# Altium schematic sheet Intermediate_LCL_Top_20230320.SchDoc
size A1; SheetNumber: 1; SheetTotal: 5
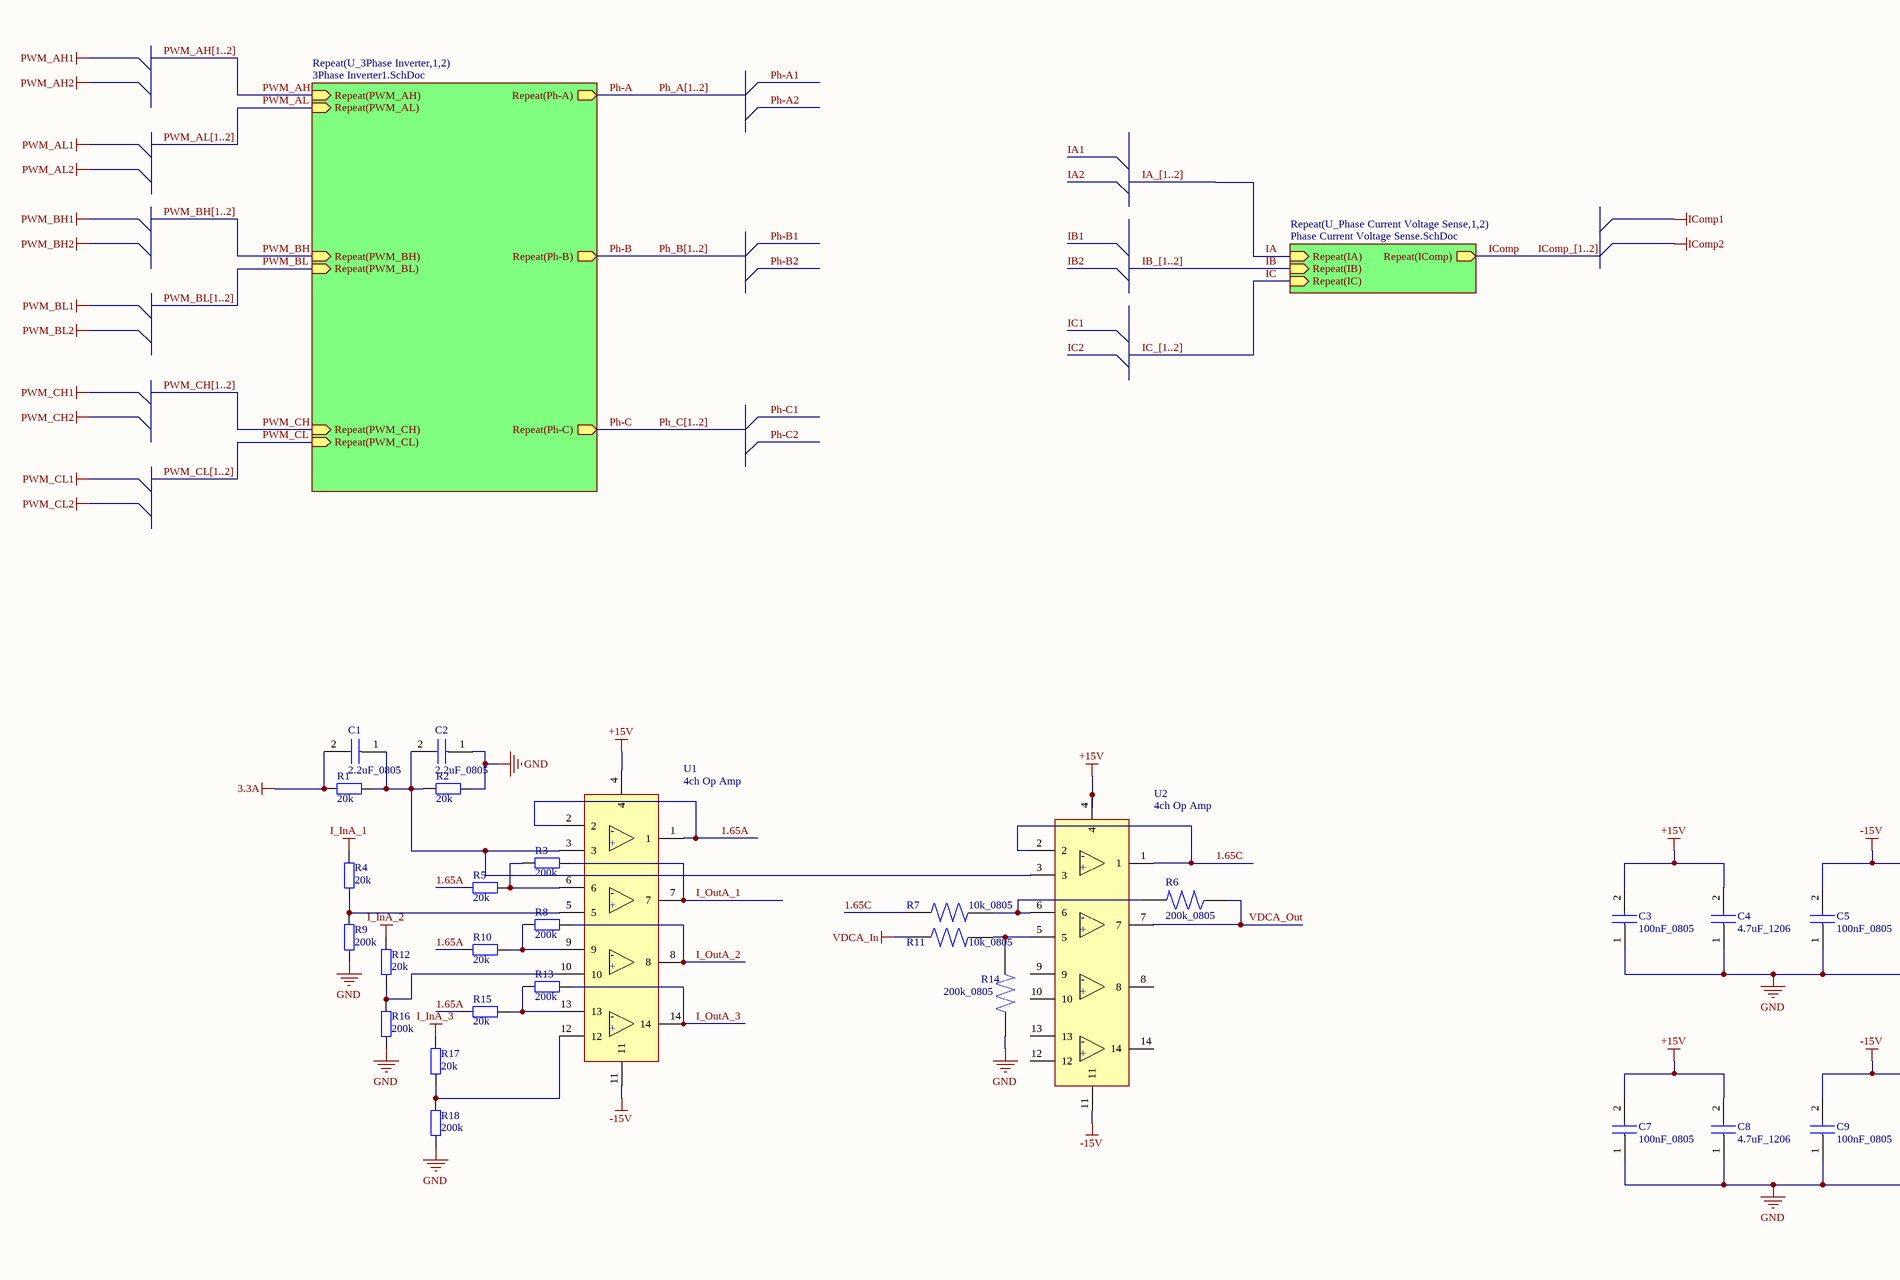
[diagram p0: Intermediate_LCL_Top_20230320.SchDoc, top left]
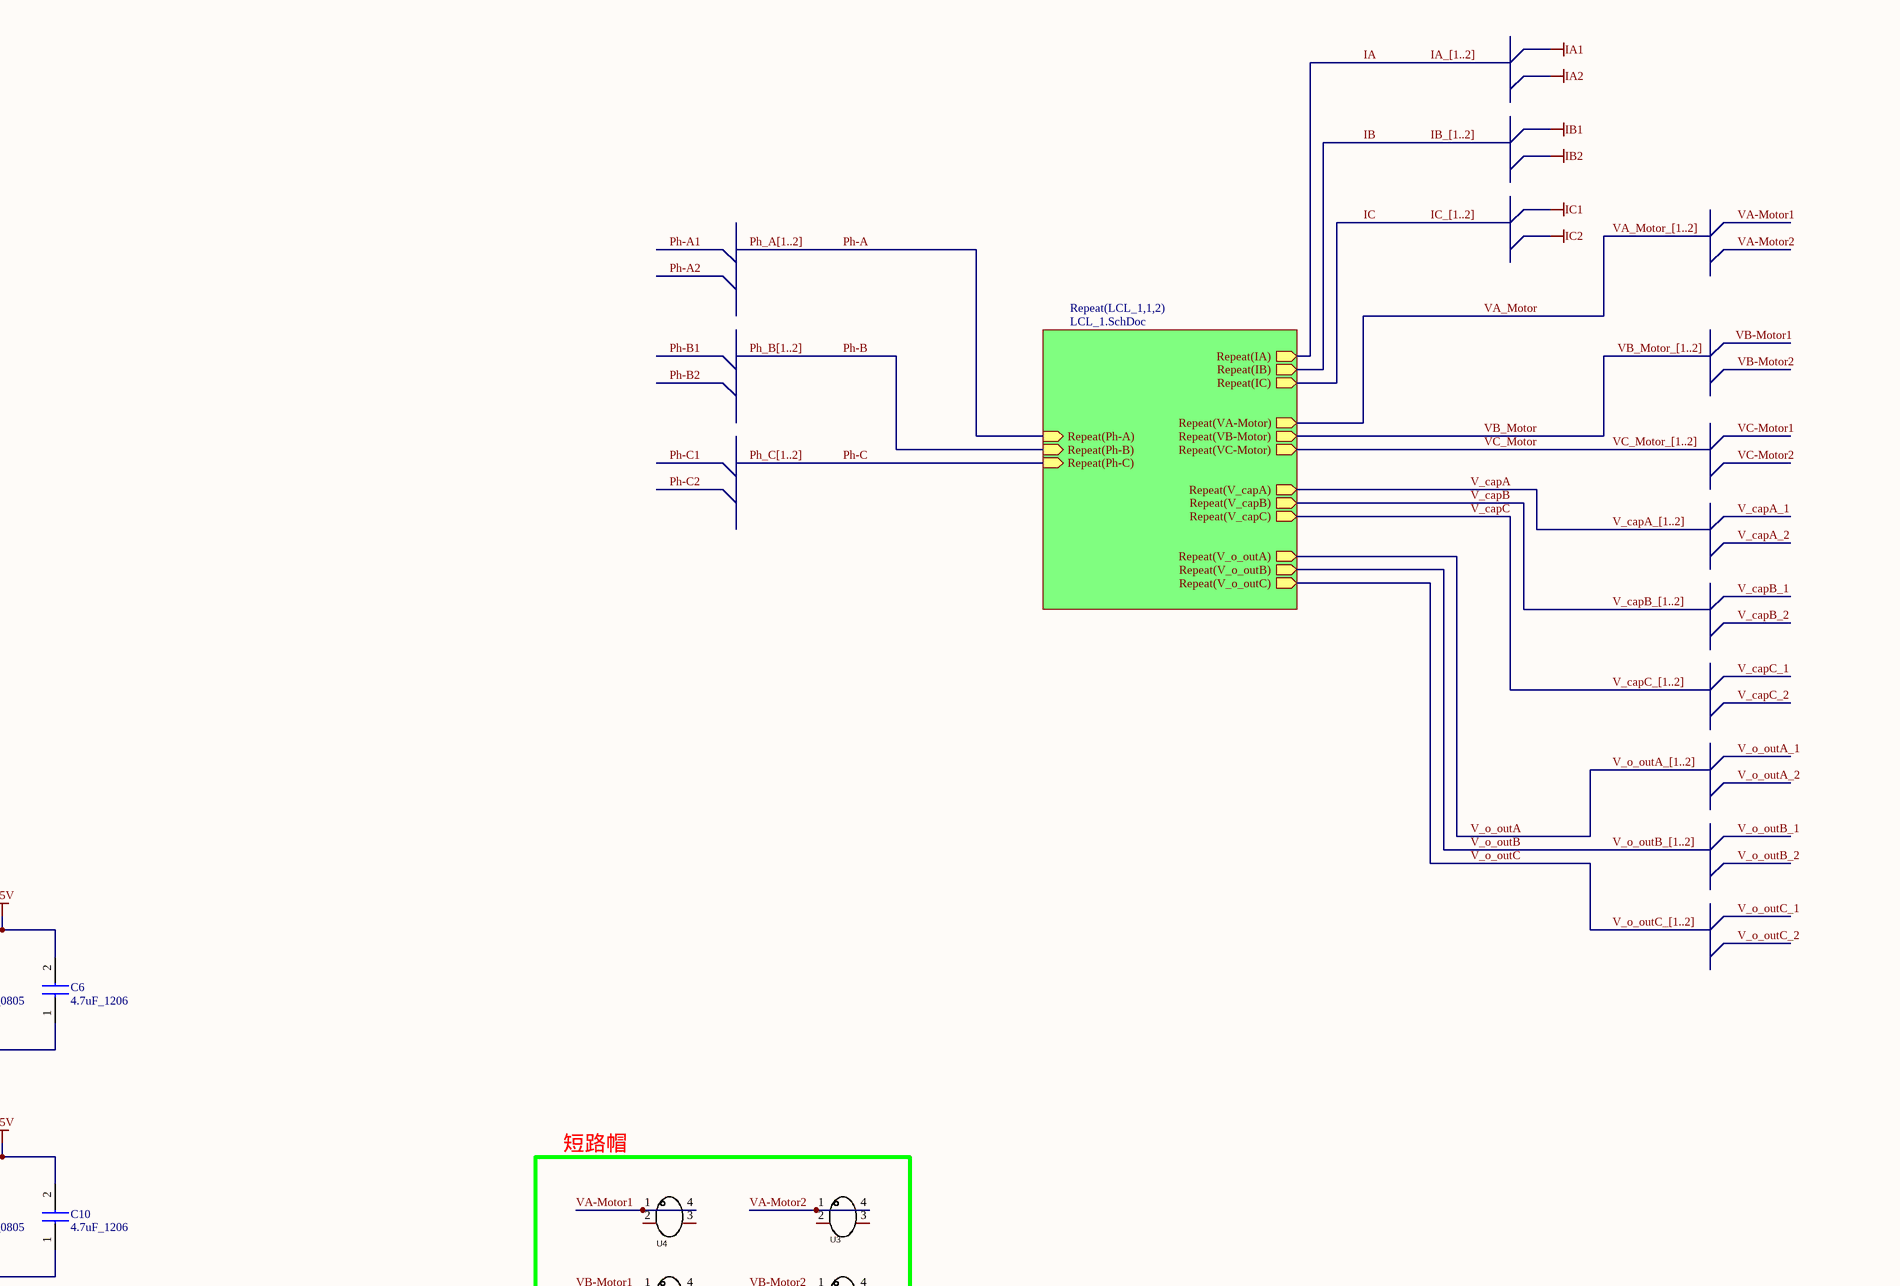
[diagram p1: Intermediate_LCL_Top_20230320.SchDoc, top right]
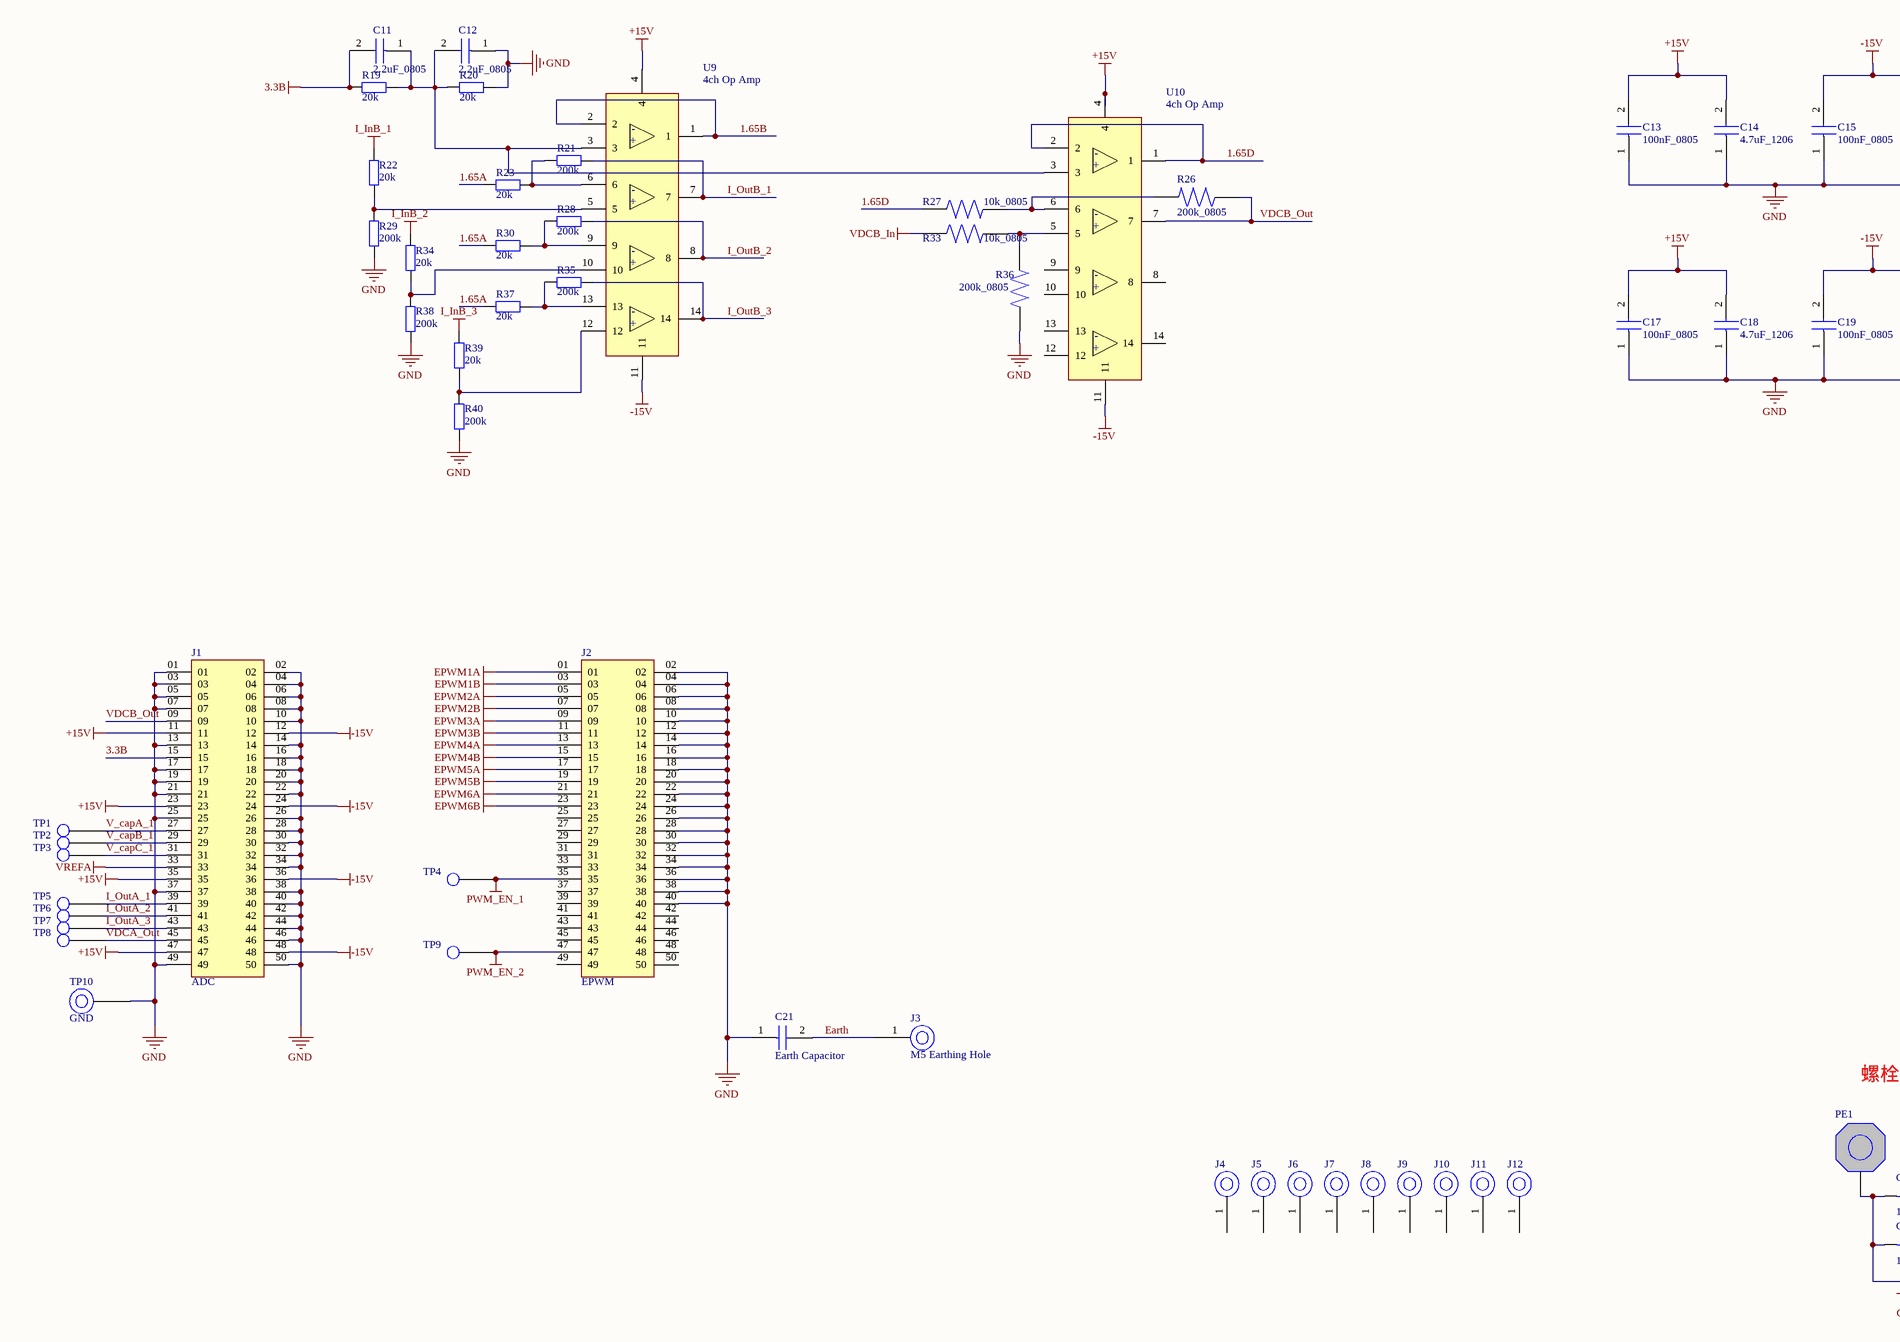
[diagram p2: Intermediate_LCL_Top_20230320.SchDoc, bottom left]
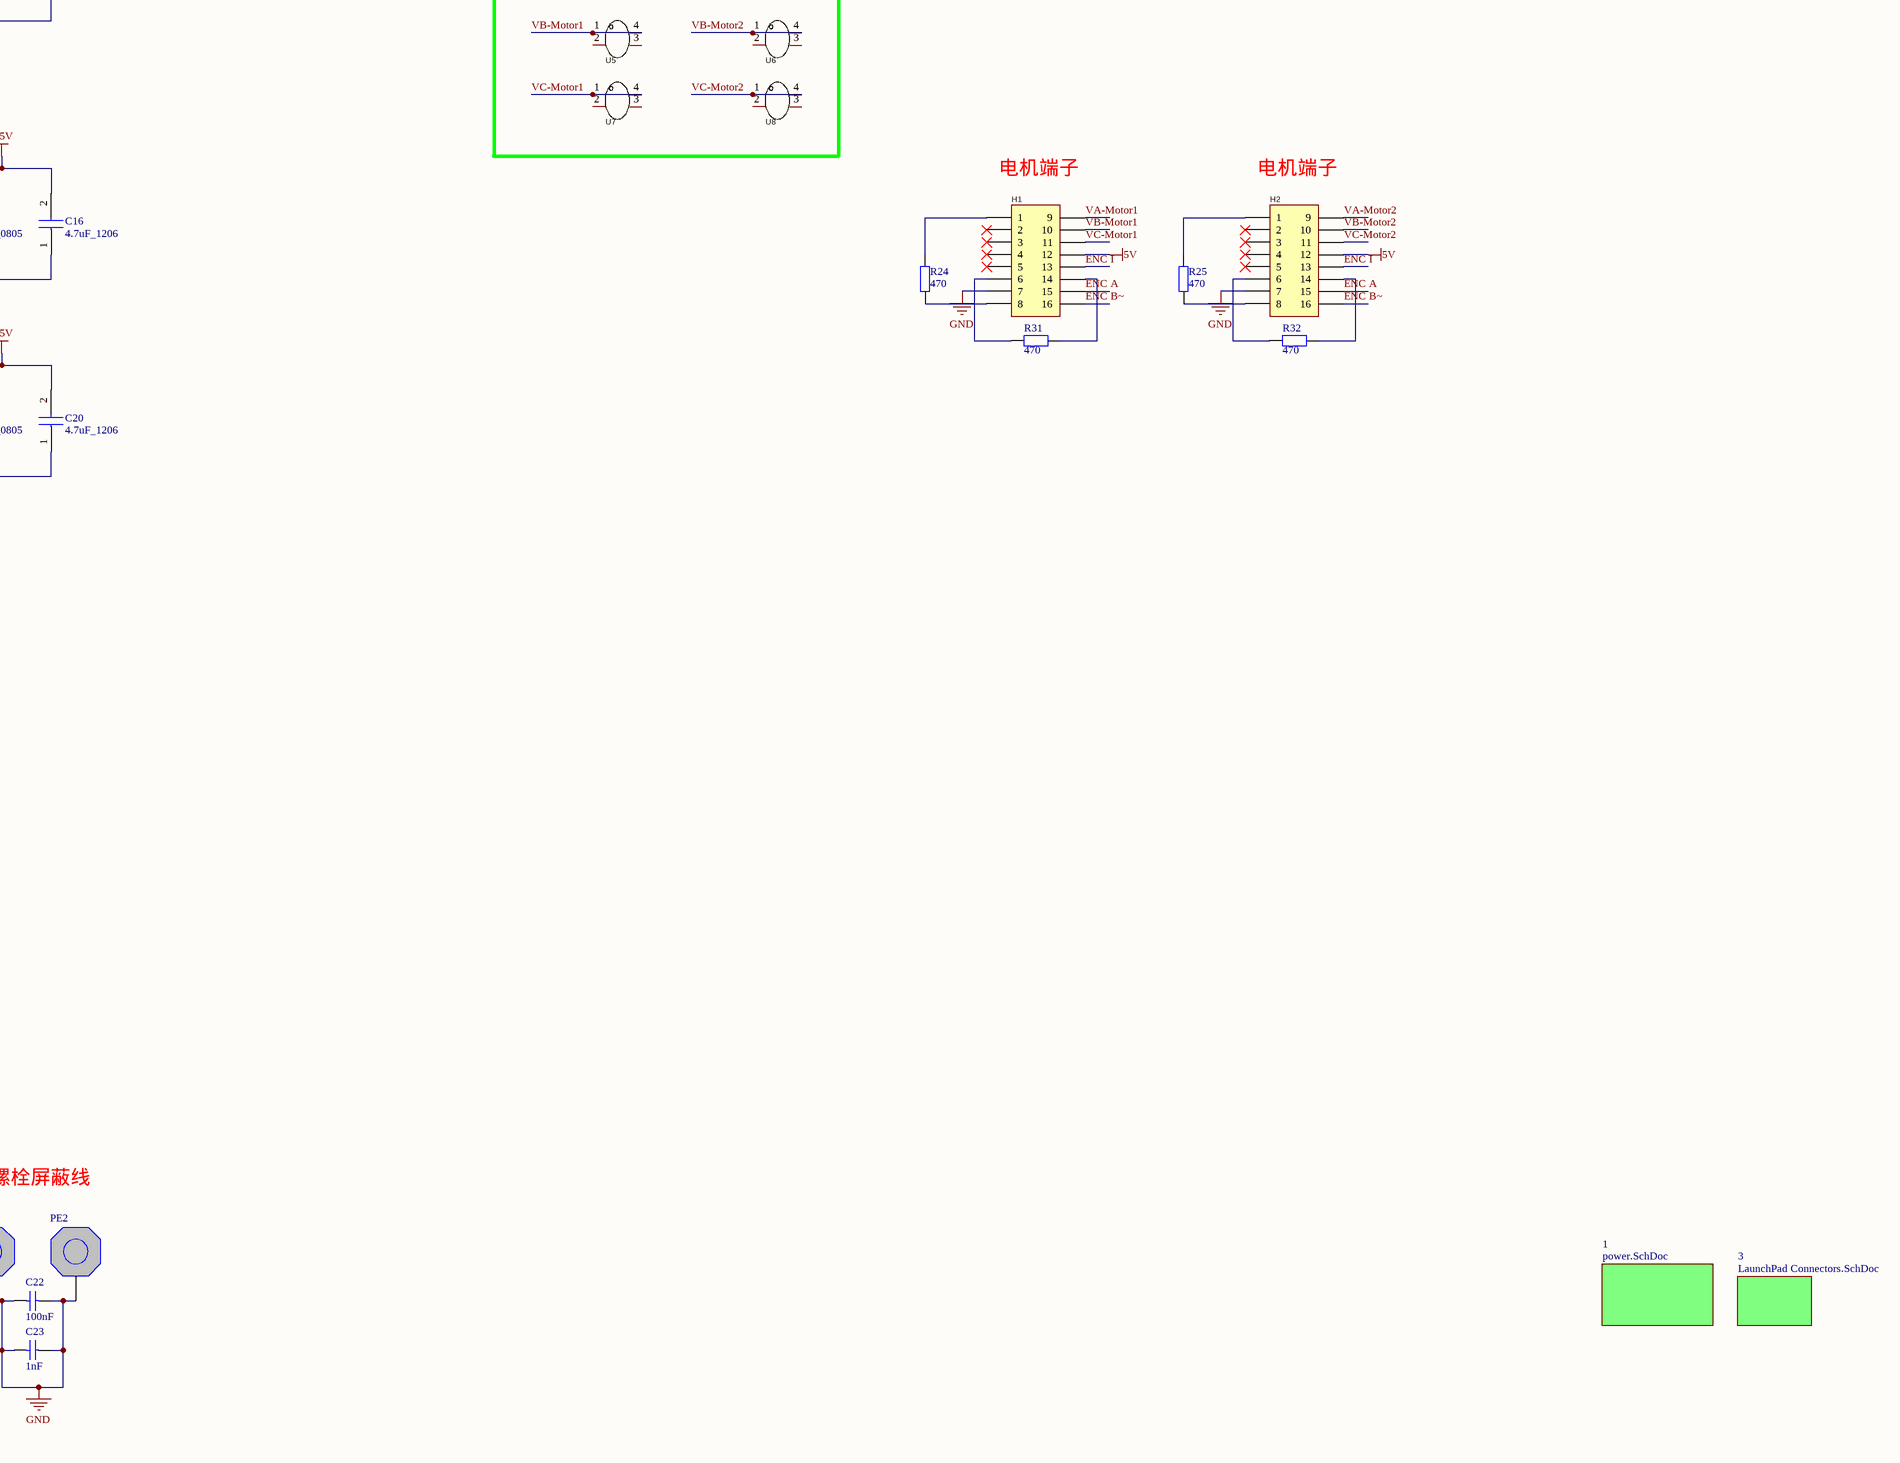
[diagram p3: Intermediate_LCL_Top_20230320.SchDoc, bottom right]

## Parts
C1  2.2uF_0805  [CAPC1608X06N]
C2  2.2uF_0805  [CAPC1608X06N]
C3  100nF_0805  [CAPC1608X06N]
C4  4.7uF_1206  [CAPC1608X06N]
C5  100nF_0805  [CAPC1608X06N]
C6  4.7uF_1206  [CAPC1608X06N]
C7  100nF_0805  [CAPC1608X06N]
C8  4.7uF_1206  [CAPC1608X06N]
C9  100nF_0805  [CAPC1608X06N]
C10  4.7uF_1206  [CAPC1608X06N]
C11  2.2uF_0805  [CAPC1608X06N]
C12  2.2uF_0805  [CAPC1608X06N]
C13  100nF_0805  [CAPC1608X06N]
C14  4.7uF_1206  [CAPC1608X06N]
C15  100nF_0805  [CAPC1608X06N]
C16  4.7uF_1206  [CAPC1608X06N]
C17  100nF_0805  [CAPC1608X06N]
C18  4.7uF_1206  [CAPC1608X06N]
C19  100nF_0805  [CAPC1608X06N]
C20  4.7uF_1206  [CAPC1608X06N]
C21  Earth Capacitor  [RAD-0.3]
C22  100nF  [CAPC1608X06N]
C23  1nF  [CAPC1608X06N]
H1  HC-5557-2*8AW  [CONN-TH_16P-P4.20_5557-2X8AW]  (value not drawn)
H2  HC-5557-2*8AW  [CONN-TH_16P-P4.20_5557-2X8AW]  (value not drawn)
J1  ADC  [SHF-125-01-L-D-RA]
J2  EPWM  [SHF-125-01-L-D-RA]
J3  M5 Earthing Hole  [M5 Earthing Hole]
J4  M5 Mounting Hole  [M5 Mounting Hole]  (value not drawn)
J5  M5 Mounting Hole  [M5 Mounting Hole]  (value not drawn)
J6  M5 Mounting Hole  [M5 Mounting Hole]  (value not drawn)
J7  M5 Mounting Hole  [M5 Mounting Hole]  (value not drawn)
J8  M5 Mounting Hole  [M5 Mounting Hole]  (value not drawn)
J9  M5 Mounting Hole  [M5 Mounting Hole]  (value not drawn)
J10  M5 Mounting Hole  [M5 Mounting Hole]  (value not drawn)
J11  M5 Mounting Hole  [M5 Mounting Hole]  (value not drawn)
J12  M5 Mounting Hole  [M5 Mounting Hole]  (value not drawn)
PE1  PE  [PE1]  (value not drawn)
PE2  PE  [PE1]  (value not drawn)
R1  20k  [RESC1608X05N]
R2  20k  [RESC1608X05N]
R3  200k  [RESC1608X05N]
R4  20k  [RESC1608X05N]
R5  20k  [RESC1608X05N]
R6  200k_0805  [RESC1608X05N]
R7  10k_0805  [RESC1608X05N]
R8  200k  [RESC1608X05N]
R9  200k  [RESC1608X05N]
R10  20k  [RESC1608X05N]
R11  10k_0805  [RESC1608X05N]
R12  20k  [RESC1608X05N]
R13  200k  [RESC1608X05N]
R14  200k_0805  [RESC1608X05N]
R15  20k  [RESC1608X05N]
R16  200k  [RESC1608X05N]
R17  20k  [RESC1608X05N]
R18  200k  [RESC1608X05N]
R19  20k  [RESC1608X05N]
R20  20k  [RESC1608X05N]
R21  200k  [RESC1608X05N]
R22  20k  [RESC1608X05N]
R23  20k  [RESC1608X05N]
R24  470  [RESC1608X05N]
R25  470  [RESC1608X05N]
R26  200k_0805  [RESC1608X05N]
R27  10k_0805  [RESC1608X05N]
R28  200k  [RESC1608X05N]
R29  200k  [RESC1608X05N]
R30  20k  [RESC1608X05N]
R31  470  [RESC1608X05N]
R32  470  [RESC1608X05N]
R33  10k_0805  [RESC1608X05N]
R34  20k  [RESC1608X05N]
R35  200k  [RESC1608X05N]
R36  200k_0805  [RESC1608X05N]
R37  20k  [RESC1608X05N]
R38  200k  [RESC1608X05N]
R39  20k  [RESC1608X05N]
R40  200k  [RESC1608X05N]
TP1  VC_1A  [PCB 1.32mm TestPoint]  (value not drawn)
TP2  VC_1B  [PCB 1.32mm TestPoint]  (value not drawn)
TP3  VC_1C  [PCB 1.32mm TestPoint]  (value not drawn)
TP4  PWMEN1  [PCB 1.32mm TestPoint]  (value not drawn)
TP5  I1  [PCB 1.32mm TestPoint]  (value not drawn)
TP6  I2  [PCB 1.32mm TestPoint]  (value not drawn)
TP7  I3  [PCB 1.32mm TestPoint]  (value not drawn)
TP8  VDC  [PCB 1.32mm TestPoint]  (value not drawn)
TP9  PWMEN2  [PCB 1.32mm TestPoint]  (value not drawn)
TP10  GND  [1.9mm Hole]
U1  4ch Op Amp  [SOIC-14]
U2  4ch Op Amp  [SOIC-14]
U3  TM54111092-1250  [CONN-TH_TM54111092-1250]  (value not drawn)
U4  TM54111092-1250  [CONN-TH_TM54111092-1250]  (value not drawn)
U5  TM54111092-1250  [CONN-TH_TM54111092-1250]  (value not drawn)
U6  TM54111092-1250  [CONN-TH_TM54111092-1250]  (value not drawn)
U7  TM54111092-1250  [CONN-TH_TM54111092-1250]  (value not drawn)
U8  TM54111092-1250  [CONN-TH_TM54111092-1250]  (value not drawn)
U9  4ch Op Amp  [SOIC-14]
U10  4ch Op Amp  [SOIC-14]

## Sub-sheets
1 = power.SchDoc: no entries
3 = LaunchPad Connectors.SchDoc: no entries
Repeat(LCL_1,1,2) = LCL_1.SchDoc: Repeat(Ph-A) (in), Repeat(Ph-B) (in), Repeat(Ph-C) (in), Repeat(IA) (out), Repeat(IB) (out), Repeat(IC) (out), Repeat(VA-Motor) (out), Repeat(VB-Motor) (out), Repeat(VC-Motor) (out), Repeat(V_o_outA) (out), Repeat(V_o_outB) (out), Repeat(V_o_outC) (out), Repeat(V_capA) (out), Repeat(V_capB) (out), Repeat(V_capC) (out)
Repeat(U_3Phase Inverter,1,2) = 3Phase Inverter1.SchDoc: Repeat(PWM_AH) (in), Repeat(PWM_AL) (in), Repeat(Ph-A) (out), Repeat(PWM_BH) (in), Repeat(PWM_BL) (in), Repeat(PWM_CH) (in), Repeat(PWM_CL) (in), Repeat(Ph-B) (out), Repeat(Ph-C) (out)
Repeat(U_Phase Current Voltage Sense,1,2) = Phase Current Voltage Sense.SchDoc: Repeat(IA) (in), Repeat(IB) (in), Repeat(IC) (in), Repeat(IComp) (out)

## Nets
3.3A: C1.2 R1.2
3.3B: C11.2 J1.15 R19.2
5V: H1.8(12) H2.8(12)
+15V: C3.2 C4.2 C7.2 C8.2 C13.2 C14.2 C17.2 C18.2 J1.11 J1.23 J1.35 J1.47 U1.4 U2.4 U9.4 U10.4
-15V: C5.2 C6.2 C9.2 C10.2 C15.2 C16.2 C19.2 C20.2 J1.12 J1.24 J1.36 J1.48 U1.11 U2.11 U9.11 U10.11
EPWM1A: J2.01
EPWM1B: J2.03
EPWM2A: J2.05
EPWM2B: J2.07
EPWM3A: J2.09
EPWM3B: J2.11
EPWM4A: J2.13
EPWM4B: J2.15
EPWM5A: J2.17
EPWM5B: J2.19
EPWM6A: J2.21
EPWM6B: J2.23
GND: C2.1 C3.1 C4.1 C5.1 C6.1 C7.1 C8.1 C9.1 C10.1 C12.1 C13.1 C14.1 C15.1 C16.1 C17.1 C18.1 C19.1 C20.1 C21.1 C22.1 C22.2 C23.1 C23.2 H1.13(7) H2.13(7) J1.01 J1.02 J1.03 J1.04 J1.05 J1.06 J1.07 J1.08 J1.10 J1.13 J1.14 J1.16 J1.17 J1.18 J1.19 J1.20 J1.21 J1.22 J1.25 J1.26 J1.28 J1.30 J1.32 J1.34 J1.37 J1.38 J1.40 J1.42 J1.44 J1.46 J1.49 J1.50 J2.02 J2.04 J2.06 J2.08 J2.10 J2.12 J2.14 J2.16 J2.18 J2.20 J2.22 J2.24 J2.26 J2.28 J2.30 J2.32 J2.34 J2.36 J2.38 J2.40 PE1.1(PE) PE2.1(PE) R2.1 R9.1 R14.2 R16.1 R18.1 R20.1 R29.1 R36.2 R38.1 R40.1 TP10.1
I_InA_1: R4.2
I_InA_2: R12.2
I_InA_3: R17.2
I_InB_1: R22.2
I_InB_2: R34.2
I_InB_3: R39.2
PWM_EN_1: J2.35 TP4.1
PWM_EN_2: J2.47 TP9.1
VDCA_In: R11.1
VDCB_In: R33.1
VREFA: J1.33
1.65A: R5.2 R10.2 R15.2 R23.2 R30.2 R37.2 U1.1 U1.2
1.65B: U9.1 U9.2
1.65C: R7.1 U2.1 U2.2
1.65D: R27.1 U10.1 U10.2
Earth: C21.2 J3.1
ENC A: H1.14(15) H2.14(15)
ENC B~: H1.16 H2.16
ENC I: H1.10(13) H2.10(13)
I_OutA_1: J1.39 R3.1 TP5.1 U1.7
I_OutA_2: J1.41 R8.1 TP6.1 U1.8
I_OutA_3: J1.43 R13.1 TP7.1 U1.14
I_OutB_1: R21.1 U9.7
I_OutB_2: R28.1 U9.8
I_OutB_3: R35.1 U9.14
IA: sheet Repeat(LCL_1,1,2)/Repeat(IA), sheet Repeat(U_Phase Current Voltage Sense,1,2)/Repeat(IA)
IB: sheet Repeat(LCL_1,1,2)/Repeat(IB), sheet Repeat(U_Phase Current Voltage Sense,1,2)/Repeat(IB)
IC: sheet Repeat(LCL_1,1,2)/Repeat(IC), sheet Repeat(U_Phase Current Voltage Sense,1,2)/Repeat(IC)
IComp: sheet Repeat(U_Phase Current Voltage Sense,1,2)/Repeat(IComp)
Ph-A: sheet Repeat(LCL_1,1,2)/Repeat(Ph-A), sheet Repeat(U_3Phase Inverter,1,2)/Repeat(Ph-A)
Ph-B: sheet Repeat(LCL_1,1,2)/Repeat(Ph-B), sheet Repeat(U_3Phase Inverter,1,2)/Repeat(Ph-B)
Ph-C: sheet Repeat(LCL_1,1,2)/Repeat(Ph-C), sheet Repeat(U_3Phase Inverter,1,2)/Repeat(Ph-C)
PWM_AH: sheet Repeat(U_3Phase Inverter,1,2)/Repeat(PWM_AH)
PWM_AL: sheet Repeat(U_3Phase Inverter,1,2)/Repeat(PWM_AL)
PWM_BH: sheet Repeat(U_3Phase Inverter,1,2)/Repeat(PWM_BH)
PWM_BL: sheet Repeat(U_3Phase Inverter,1,2)/Repeat(PWM_BL)
PWM_CH: sheet Repeat(U_3Phase Inverter,1,2)/Repeat(PWM_CH)
PWM_CL: sheet Repeat(U_3Phase Inverter,1,2)/Repeat(PWM_CL)
V_capA: sheet Repeat(LCL_1,1,2)/Repeat(V_capA)
V_capA_1: J1.27 TP1.1
V_capB: sheet Repeat(LCL_1,1,2)/Repeat(V_capB)
V_capB_1: J1.29 TP2.1
V_capC: sheet Repeat(LCL_1,1,2)/Repeat(V_capC)
V_capC_1: J1.31 TP3.1
V_o_outA: sheet Repeat(LCL_1,1,2)/Repeat(V_o_outA)
V_o_outB: sheet Repeat(LCL_1,1,2)/Repeat(V_o_outB)
V_o_outC: sheet Repeat(LCL_1,1,2)/Repeat(V_o_outC)
VA-Motor1: H1.2(9) U4.1 U4.4
VA-Motor2: H2.2(9) U3.1 U3.4
VA_Motor: sheet Repeat(LCL_1,1,2)/Repeat(VA-Motor)
VB-Motor1: H1.4(10) U5.1 U5.4
VB-Motor2: H2.4(10) U6.1 U6.4
VB_Motor: sheet Repeat(LCL_1,1,2)/Repeat(VB-Motor)
VC-Motor1: H1.6(11) U7.1 U7.4
VC-Motor2: H2.6(11) U8.1 U8.4
VC_Motor: sheet Repeat(LCL_1,1,2)/Repeat(VC-Motor)
VDCA_Out: J1.45 R6.1 TP8.1 U2.7
VDCB_Out: J1.09 R26.1 U10.7
NetC1_1: C1.1 C2.2 R1.1 R2.2 U1.3 U2.3
NetC11_1: C11.1 C12.2 R19.1 R20.2 U9.3 U10.3
NetH1_1: H1.1 R24.2
NetH1_11: H1.11(6) R31.2
NetH1_12: H1.12(14) R31.1
NetH1_15: H1.15(8) R24.1
NetH2_1: H2.1 R25.2
NetH2_11: H2.11(6) R32.2
NetH2_12: H2.12(14) R32.1
NetH2_15: H2.15(8) R25.1
NetR3_2: R3.2 R5.1 U1.6
NetR4_1: R4.1 R9.2 U1.5
NetR6_2: R6.2 R7.2 U2.6
NetR8_2: R8.2 R10.1 U1.9
NetR11_2: R11.2 R14.1 U2.5
NetR12_1: R12.1 R16.2 U1.10
NetR13_2: R13.2 R15.1 U1.13
NetR17_1: R17.1 R18.2 U1.12
NetR21_2: R21.2 R23.1 U9.6
NetR22_1: R22.1 R29.2 U9.5
NetR26_2: R26.2 R27.2 U10.6
NetR28_2: R28.2 R30.1 U9.9
NetR33_2: R33.2 R36.1 U10.5
NetR34_1: R34.1 R38.2 U9.10
NetR35_2: R35.2 R37.1 U9.13
NetR39_1: R39.1 R40.2 U9.12

Not connected (* = marked no-connect by the designer): H1 3(2)* 5(3)* 7(4)* 9(5)*; H2 3(2)* 5(3)* 7(4)* 9(5)*; J2 25 27 29 31 33 37 39 41 42 43 44 45 46 48 49 50; J4 1; J5 1; J6 1; J7 1; J8 1; J9 1; J10 1; J11 1; J12 1; U2 8 9 10 12 13 14; U3 2 3; U4 2 3; U5 2 3; U6 2 3; U7 2 3; U8 2 3; U10 8 9 10 12 13 14

## Buses and harness runs
bus IA_[1..2]
bus IB_[1..2]
bus IC_[1..2]
bus IComp_[1..2]
bus Ph_A[1..2]
bus Ph_B[1..2]
bus Ph_C[1..2]
bus PWM_AH[1..2]
bus PWM_AL[1..2]
bus PWM_BH[1..2]
bus PWM_BL[1..2]
bus PWM_CH[1..2]
bus PWM_CL[1..2]
bus V_capA_[1..2]
bus V_capB_[1..2]
bus V_capC_[1..2]
bus V_o_outA_[1..2]
bus V_o_outB_[1..2]
bus V_o_outC_[1..2]
bus VA_Motor_[1..2]
bus VB_Motor_[1..2]
bus VC_Motor_[1..2]

## Notes on the sheet
- 短路帽
- (near H1) 电机端子
- (near H2) 电机端子
- 螺栓屏蔽线
- (in symbol TL074D) -; +

## Library data of the parts
C1 C2 C11 C12 = C2012X5R1H225K125AB: SMD Multilayer Ceramic Capacitor, 2.2 µF, 50 V, 0805 [2012 Metric], ± 10%, X5R, C
C3 C5 C7 C9 C13 C15 C17 C19 = C0805C104J5RACTU: SMD Multilayer Ceramic Capacitor, 0.1 µF, 50 V, 0805 [2012 Metric], ± 5%, X7R, C Series KEMET
C4 C6 C8 C10 C14 C16 C18 C20 = C3216X7R1H475K160AC: SMD Multilayer Ceramic Capacitor, 4.7 µF, 50 V, 1206 [3216 Metric], ± 10%, X7R, C; MP: C1206C120J5GACTU; Package: None; Price: None; Value: *; Availability: Unavailable
C21 = 102_Y: Y Earth Capacitor; MP: C1206C120J5GACTU; Package: None; Price: None; Value: *; Availability: Unavailable
C22 C23 = Cap: Capacitor; Published: 8-Jun-2000; LatestRevisionDate: 17-Jul-2002; LatestRevisionNote: Re-released for DXP Platform.; PackageReference: RAD-0.3; Publisher: Altium Limited; PackageDescription: Radial Cap, Thru-Hole; 2 Leads; 0.3 in Pin Spacing
  C22: Value: 100nF
  C23: Value: 1nF
H1 H2 = HC-5557-2*8AW: Manufacturer: HCTL(华灿天禄); Add into BOM: yes; Pins Structure: 2x8P; Pitch: 4.2mm; Number of PINs Per Row: 8; Current Rating (Max): 9A; Symbol: HC-5557-2*8AW; Device: HC-5557-2*8AW; LCSC Part Name: 2x8P 间距:4.2mm 弯插; Supplier Part: C2845793; Manufacturer Part: HC-5557-2*8AW; Supplier Footprint: 弯插,P=4.2mm; JLCPCB Part Class: Extended Part; Datasheet: https://atta.szlcsc.com/upload/public/pdf/source/20230620/3AA4118B2C2E81189EA8FE45B17A7E9B.pdf; Supplier: LCSC; Convert to PCB: yes; Mounting Style: 弯插; Reference Series: -; Number of Pins: 16P; Number of Rows: 2; Row Spacing: 4.2mm; Contact Material: 黄铜; Contact Plating: 锡; Operating Temperature Range: -25℃~+85℃
J1 J2 = SHF-125-01-L-D-RA: 50-Pin Simplus Connector; MF: Samtec; MP: SHF-125-01-L-D-RA; Package: None; Price: None; Availability: Unavailable; Value: *
R1-R5 R8-R10 R12 R13 R15-R23 R28-R30 R34 R35 R37-R40 = 0603 100KΩ (1003) 1%_4: 贴片电阻; Value: 1MΩ(1%); ComponentLink1Description: 供应商链接; ComponentLink1URL: http://www.szlcsc.com/product/details_26546.html; Package: 0603; Supplier: LC; SuppliersPartNumber: C25803
R6 R14 R26 R36 = CRCW0805200KFKEA: SMD Chip Resistor, 200 kohm, ± 1%, 125 mW, 0805 [2012 Metric], Thick Film, General Purpose; MF: Bourns; MP: CRE2512-FZ-R007E-3; Mouser-Purchase-URL: https://snapeda.com/shop?store=Mouser&id=836123; Price: None; Package: 6432 Stackpole; Value: *; SnapEDA_Link: https://www.snapeda.com/parts/CRE2512-FZ-R007E-3/Bourns/view-part/836123/?ref=snap; DigiKey-Purchase-URL: https://snapeda.com/shop?store=DigiKey&id=836123; Availability: Good
R7 R11 R27 R33 = CRCW080510K0FKEA: SMD Chip Resistor, 10 kohm, ± 1%, 125 mW, 0805 [2012 Metric], Thick Film, General Purpose; MF: Bourns; MP: CRE2512-FZ-R007E-3; Mouser-Purchase-URL: https://snapeda.com/shop?store=Mouser&id=836123; Price: None; Package: 6432 Stackpole; Value: *; SnapEDA_Link: https://www.snapeda.com/parts/CRE2512-FZ-R007E-3/Bourns/view-part/836123/?ref=snap; DigiKey-Purchase-URL: https://snapeda.com/shop?store=DigiKey&id=836123; Availability: Good
R24 R25 R31 R32 = 0603 100KΩ (1003) 1%_4: 贴片电阻; Value: 470Ω(1%); ComponentLink1Description: 供应商链接; ComponentLink1URL: http://www.szlcsc.com/product/details_26546.html; Package: 0603; Supplier: LC; SuppliersPartNumber: C25803
TP1-TP9 = PCBTestpoint: 20-313143 PCB Test Point, White, Through Hole Mount, 1.32 mm, Phosphor Bronze, Tin Plated Contacts
TP10 = GroundTestPoint: H2182-01 PCB Test Point, PCB Mount, 1.9 mm, Brass, Tin Plated Contacts
U1 U2 U9 U10 = TL074D: Quad, 30-V, 3-MHz, high slew rate (13-V/µs), In to V+, JFET-input op amp
U3-U8 = TM54111092-1250: Manufacturer: XFCN(兴飞); Add into BOM: yes; Screw Hole Size: M5; Number of Leg: 4; Symbol: TM54111092-1250; Device: TM54111092-1250; LCSC Part Name: PCB焊接端子 压铆螺母 M5  四脚 11.1x9.2x12.5mm; Supplier Part: C7496724; Manufacturer Part: TM54111092-1250; Supplier Footprint: 插件; JLCPCB Part Class: Extended Part; Datasheet: https://atta.szlcsc.com/upload/public/pdf/source/20230928/FD02072F9AD821C125C72594ABD5C09B.pdf; Supplier: LCSC; Convert to PCB: yes